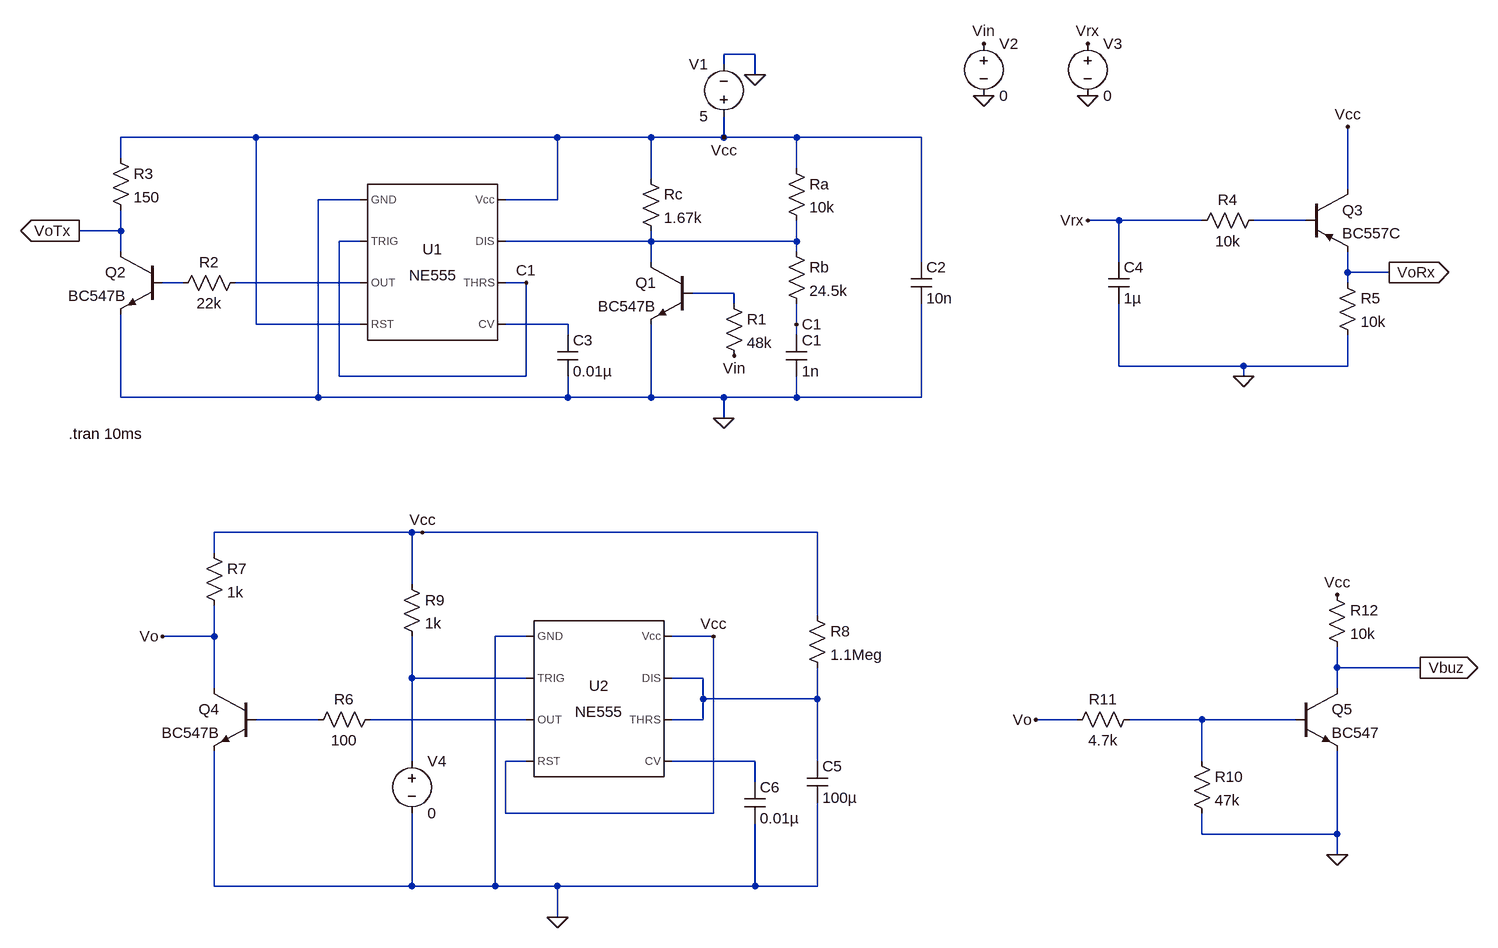
[diagram p0: schematic tx_rx.asc]
tx_rx.asc, the LTspice schematic file:
Version 4
SHEET 1 4472 1364
WIRE -144 -208 -192 -208
WIRE -192 -192 -192 -208
WIRE -144 -176 -144 -208
WIRE -912 -80 -1120 -80
WIRE -448 -80 -912 -80
WIRE -304 -80 -448 -80
WIRE -192 -80 -192 -112
WIRE -192 -80 -304 -80
WIRE -80 -80 -192 -80
WIRE 112 -80 -80 -80
WIRE -1120 -48 -1120 -80
WIRE -80 -32 -80 -80
WIRE -304 -16 -304 -80
WIRE 768 0 768 -96
WIRE -752 16 -816 16
WIRE -448 16 -448 -80
WIRE -448 16 -528 16
WIRE 416 48 368 48
WIRE 544 48 416 48
WIRE 704 48 624 48
WIRE -1120 64 -1120 32
WIRE -1120 64 -1184 64
WIRE -752 80 -784 80
WIRE -304 80 -304 64
WIRE -304 80 -528 80
WIRE -80 80 -80 48
WIRE -80 80 -304 80
WIRE -1120 96 -1120 64
WIRE -80 96 -80 80
WIRE -304 112 -304 80
WIRE 112 112 112 -80
WIRE 416 112 416 48
WIRE 768 128 768 96
WIRE 832 128 768 128
WIRE -1024 144 -1056 144
WIRE -752 144 -944 144
WIRE -496 144 -528 144
WIRE 768 144 768 128
WIRE -176 160 -240 160
WIRE -176 176 -176 160
WIRE -912 208 -912 -80
WIRE -752 208 -912 208
WIRE -432 208 -528 208
WIRE -80 208 -80 176
WIRE -432 224 -432 208
WIRE -80 224 -80 208
WIRE 416 272 416 176
WIRE 608 272 416 272
WIRE 768 272 768 224
WIRE 768 272 608 272
WIRE -784 288 -784 80
WIRE -496 288 -496 144
WIRE -496 288 -784 288
WIRE 608 288 608 272
WIRE -1120 320 -1120 192
WIRE -816 320 -816 16
WIRE -816 320 -1120 320
WIRE -432 320 -432 288
WIRE -432 320 -816 320
WIRE -304 320 -304 208
WIRE -304 320 -432 320
WIRE -192 320 -304 320
WIRE -80 320 -80 288
WIRE -80 320 -192 320
WIRE 112 320 112 176
WIRE 112 320 -80 320
WIRE -192 352 -192 320
WIRE -672 528 -976 528
WIRE -656 528 -672 528
WIRE -48 528 -656 528
WIRE -976 560 -976 528
WIRE -672 608 -672 528
WIRE -48 656 -48 528
WIRE -976 688 -976 640
WIRE -976 688 -1056 688
WIRE -496 688 -544 688
WIRE -208 688 -272 688
WIRE 752 736 752 704
WIRE 880 736 752 736
WIRE -672 752 -672 688
WIRE -496 752 -672 752
WIRE -224 752 -272 752
WIRE -976 768 -976 688
WIRE 752 768 752 736
WIRE -224 784 -224 752
WIRE -48 784 -48 736
WIRE -48 784 -224 784
WIRE -816 816 -912 816
WIRE -496 816 -736 816
WIRE -224 816 -224 784
WIRE -224 816 -272 816
WIRE 352 816 288 816
WIRE 544 816 432 816
WIRE 688 816 544 816
WIRE -672 880 -672 752
WIRE -496 880 -528 880
WIRE -144 880 -272 880
WIRE -48 880 -48 784
WIRE 544 880 544 816
WIRE -144 912 -144 880
WIRE -528 960 -528 880
WIRE -208 960 -208 688
WIRE -208 960 -528 960
WIRE 544 992 544 960
WIRE 752 992 752 864
WIRE 752 992 544 992
WIRE 752 1024 752 992
WIRE -976 1072 -976 864
WIRE -672 1072 -672 960
WIRE -672 1072 -976 1072
WIRE -544 1072 -544 688
WIRE -544 1072 -672 1072
WIRE -448 1072 -544 1072
WIRE -144 1072 -144 976
WIRE -144 1072 -448 1072
WIRE -48 1072 -48 944
WIRE -48 1072 -144 1072
WIRE -448 1120 -448 1072
FLAG -144 -176 0
FLAG -80 208 C1
FLAG -496 144 C1
FLAG -192 352 0
FLAG -176 256 Vin
FLAG 208 -224 Vin
FLAG 208 -144 0
FLAG 768 -96 Vcc
FLAG -192 -80 Vcc
FLAG 608 288 0
FLAG 368 -144 0
FLAG 368 -224 Vrx
FLAG 368 48 Vrx
FLAG 832 128 VoRx
IOPIN 832 128 Out
FLAG -1184 64 VoTx
IOPIN -1184 64 Out
FLAG -448 1120 0
FLAG -656 528 Vcc
FLAG -208 688 Vcc
FLAG 752 624 Vcc
FLAG 752 1024 0
FLAG 288 816 Vo
FLAG 880 736 Vbuz
IOPIN 880 736 Out
FLAG -1056 688 Vo
DATAFLAG 768 736 ""
DATAFLAG 768 736 ""
SYMBOL Misc\\NE555 -640 112 R0
SYMATTR InstName U1
SYMBOL npn -240 112 M0
SYMATTR InstName Q1
SYMATTR Value BC547B
SYMBOL res -320 -32 R0
SYMATTR InstName Rc
SYMATTR Value 1.67k
SYMBOL res -96 80 R0
SYMATTR InstName Rb
SYMATTR Value 24.5k
SYMBOL res -96 -48 R0
SYMATTR InstName Ra
SYMATTR Value 10k
SYMBOL cap -96 224 R0
SYMATTR InstName C1
SYMATTR Value 1n
SYMBOL cap 96 112 R0
SYMATTR InstName C2
SYMATTR Value 10n
SYMBOL voltage -192 -96 R180
WINDOW 0 24 96 Left 2
WINDOW 3 24 16 Left 2
WINDOW 123 0 0 Left 0
WINDOW 39 0 0 Left 0
SYMATTR InstName V1
SYMATTR Value 5
SYMBOL res -192 160 R0
SYMATTR InstName R1
SYMATTR Value 48k
SYMBOL cap -448 224 R0
SYMATTR InstName C3
SYMATTR Value 0.01µ
SYMBOL npn -1056 96 M0
SYMATTR InstName Q2
SYMATTR Value BC547B
SYMBOL res -928 128 R90
WINDOW 0 0 56 VBottom 2
WINDOW 3 32 56 VTop 2
SYMATTR InstName R2
SYMATTR Value 22k
SYMBOL res -1136 -64 R0
SYMATTR InstName R3
SYMATTR Value 150
SYMBOL voltage 208 -240 R0
WINDOW 123 0 0 Left 0
WINDOW 39 0 0 Left 0
SYMATTR InstName V2
SYMATTR Value 0
SYMBOL pnp 704 0 R0
SYMATTR InstName Q3
SYMATTR Value BC557C
SYMBOL res 752 128 R0
SYMATTR InstName R5
SYMATTR Value 10k
SYMBOL voltage 368 -240 R0
WINDOW 123 0 0 Left 0
WINDOW 39 0 0 Left 0
SYMATTR InstName V3
SYMATTR Value 0
SYMBOL cap 400 112 R0
SYMATTR InstName C4
SYMATTR Value 1µ
SYMBOL res 640 32 R90
WINDOW 0 0 56 VBottom 2
WINDOW 3 32 56 VTop 2
SYMATTR InstName R4
SYMATTR Value 10k
SYMBOL Misc\\NE555 -384 784 R0
SYMATTR InstName U2
SYMBOL res -720 800 R90
WINDOW 0 0 56 VBottom 2
WINDOW 3 32 56 VTop 2
SYMATTR InstName R6
SYMATTR Value 100
SYMBOL npn -912 768 M0
SYMATTR InstName Q4
SYMATTR Value BC547B
SYMBOL res -64 640 R0
SYMATTR InstName R8
SYMATTR Value 1.1Meg
SYMBOL res -688 592 R0
SYMATTR InstName R9
SYMATTR Value 1k
SYMBOL cap -64 880 R0
SYMATTR InstName C5
SYMATTR Value 100µ
SYMBOL cap -160 912 R0
SYMATTR InstName C6
SYMATTR Value 0.01µ
SYMBOL res -992 544 R0
SYMATTR InstName R7
SYMATTR Value 1k
SYMBOL npn 688 768 R0
SYMATTR InstName Q5
SYMATTR Value BC547
SYMBOL res 528 864 R0
SYMATTR InstName R10
SYMATTR Value 47k
SYMBOL res 448 800 R90
WINDOW 0 0 56 VBottom 2
WINDOW 3 32 56 VTop 2
SYMATTR InstName R11
SYMATTR Value 4.7k
SYMBOL res 736 608 R0
SYMATTR InstName R12
SYMATTR Value 10k
SYMBOL voltage -672 864 R0
WINDOW 123 0 0 Left 0
WINDOW 39 0 0 Left 0
SYMATTR InstName V4
SYMATTR Value 0
TEXT -1200 376 Left 2 !.tran 10ms

The netlist it stands for:
* tx_rx.asc
XU1 0 C1 N004 Vcc N006 C1 N002 Vcc NE555  ; pins GND TRIG OUT RST CV THRS DIS Vcc
Q1 N002 N005 0 0 BC547B
Rc Vcc N002 1.67k
Rb N002 C1 24.5k
Ra Vcc N002 10k
C1 C1 0 1n
C2 Vcc 0 10n
V1 Vcc 0 5
R1 N005 Vin 48k
C3 N006 0 0.01µ
Q2 VoTx N003 0 0 BC547B
R2 N004 N003 22k
R3 Vcc VoTx 150
V2 Vin 0 0
Q3 Vcc N001 VoRx 0 BC557C
R5 VoRx 0 10k
V3 Vrx 0 0
C4 Vrx 0 1µ
R4 N001 Vrx 10k
XU2 0 N007 N010 Vcc N012 N008 N008 Vcc NE555  ; pins GND TRIG OUT RST CV THRS DIS Vcc
R6 N010 N009 100
Q4 Vo N009 0 0 BC547B
R8 Vcc N008 1.1Meg
R9 Vcc N007 1k
C5 N008 0 100µ
C6 N012 0 0.01µ
R7 Vcc Vo 1k
Q5 Vbuz N011 0 0 BC547
R10 N011 0 47k
R11 N011 Vo 4.7k
R12 Vcc Vbuz 10k
V4 N007 0 0
.model NPN NPN
.model PNP PNP
.lib standard.bjt
.tran 10ms
.lib NE555.sub
.backanno
.end